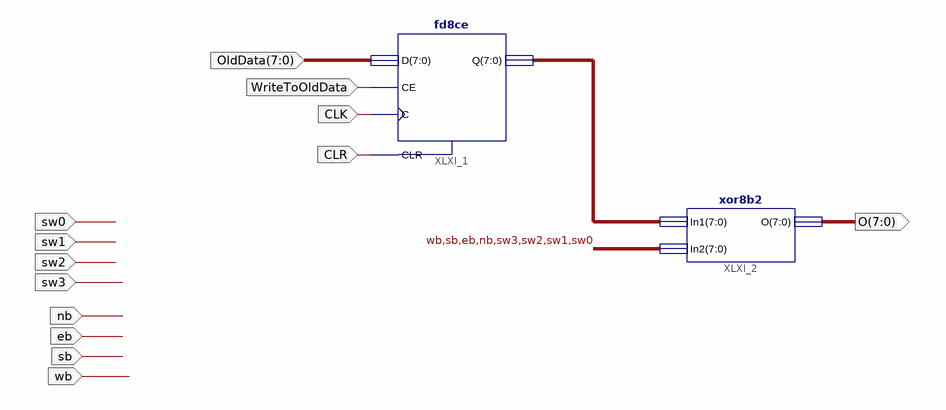
[diagram p0: schematic sheet 1]
// Xilinx ISE schematic InputSelect.sch (spartan3e) as structural Verilog: 2 symbols, 13 ports
module InputSelect (
  input  [7:0] OldData,
  input  CLR,
  input  WriteToOldData,
  input  CLK,
  input  sw0,
  input  sw1,
  input  sw2,
  input  sw3,
  input  nb,
  input  eb,
  input  sb,
  input  wb,
  output [7:0] O
);

  wire [7:0] XLXN_1;

  fd8ce XLXI_1 (.C(CLK), .CE(WriteToOldData), .CLR(CLR), .D(OldData), .Q(XLXN_1));
  xor8b2 XLXI_2 (.In1(XLXN_1), .In2({wb, sb, eb, nb, sw3, sw2, sw1, sw0}), .O(O));
endmodule
